# EAGLE schematic untitled (EAGLE 6.3)
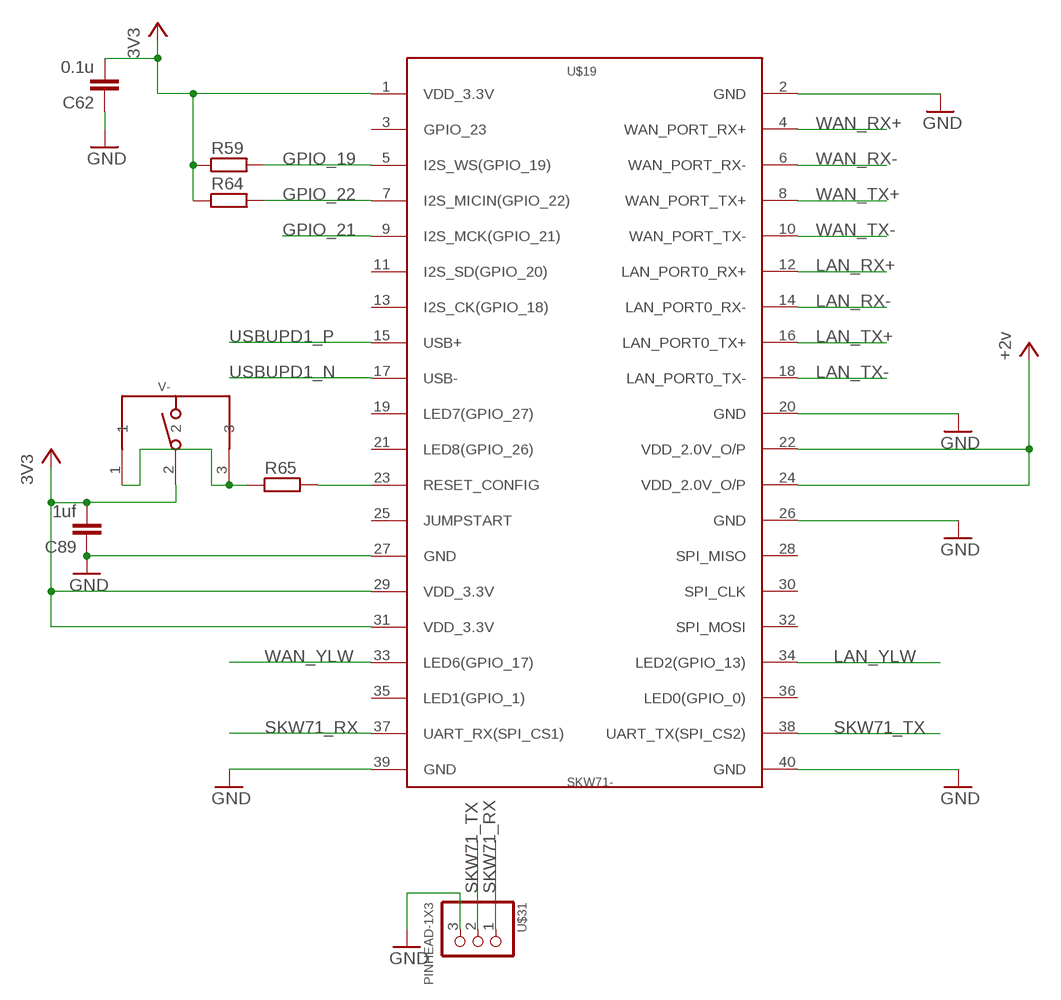
[diagram p0: schematic, sheet 1, part 1 of 3]
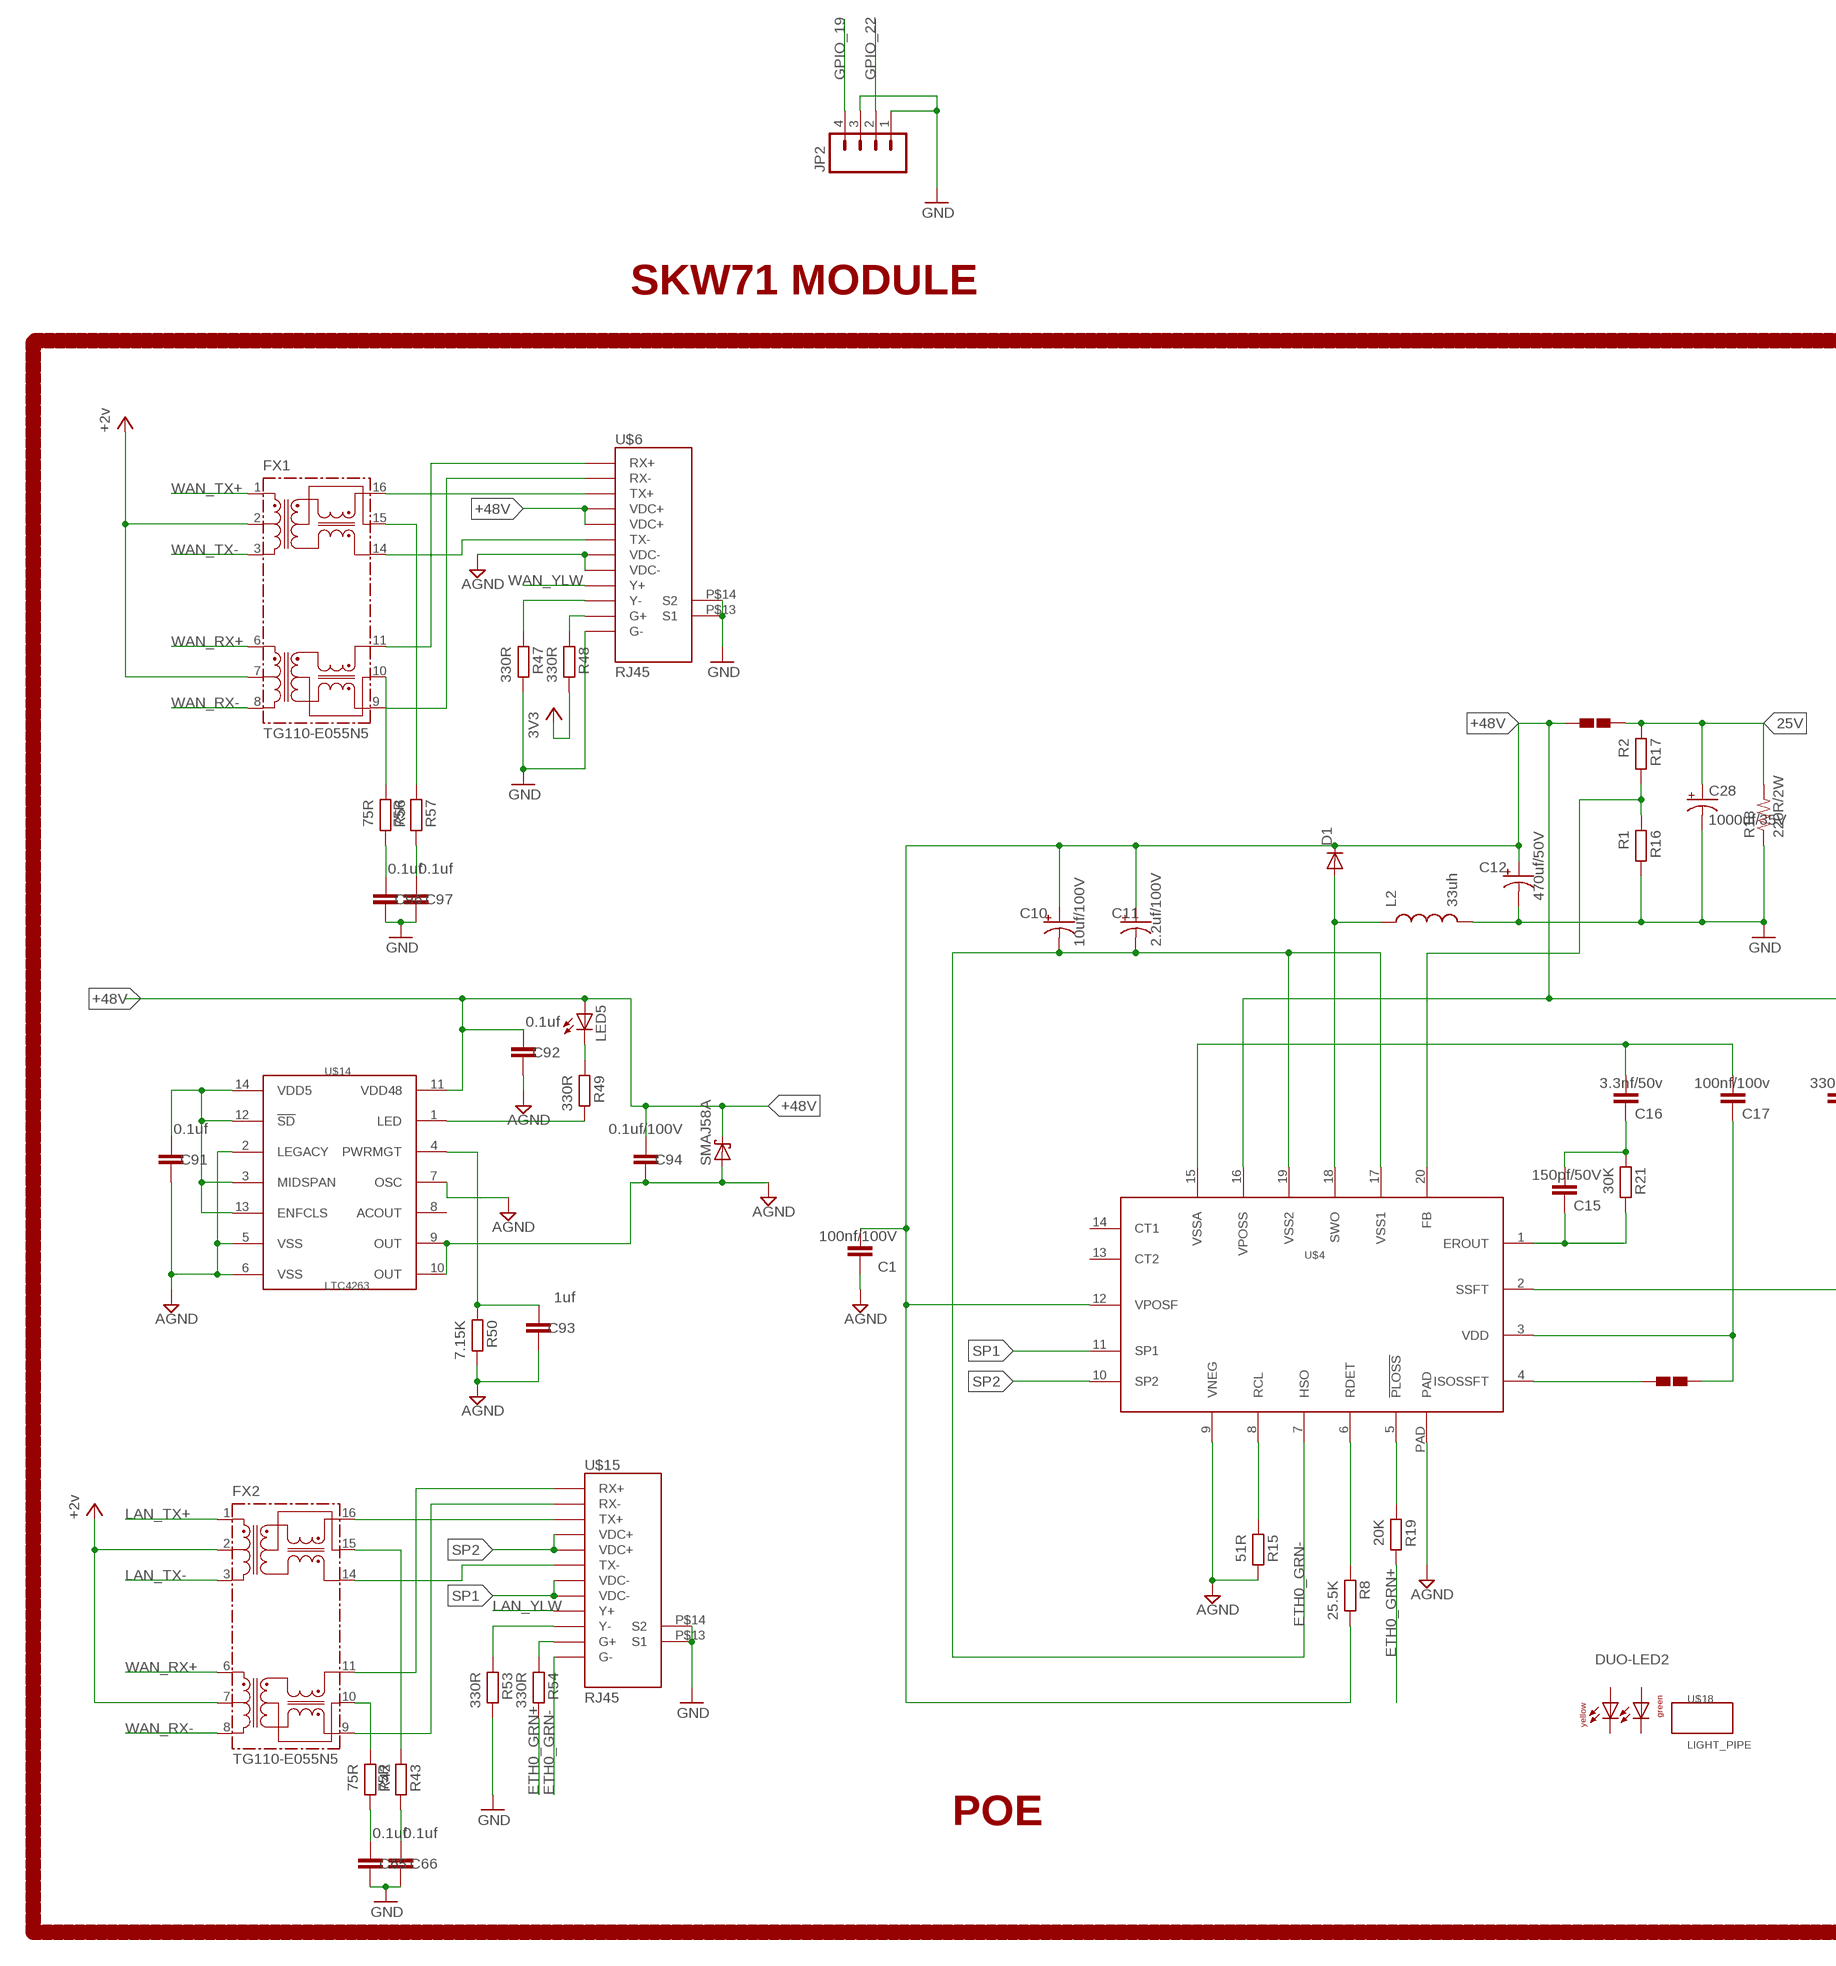
[diagram p1: schematic, sheet 1, part 2 of 3]
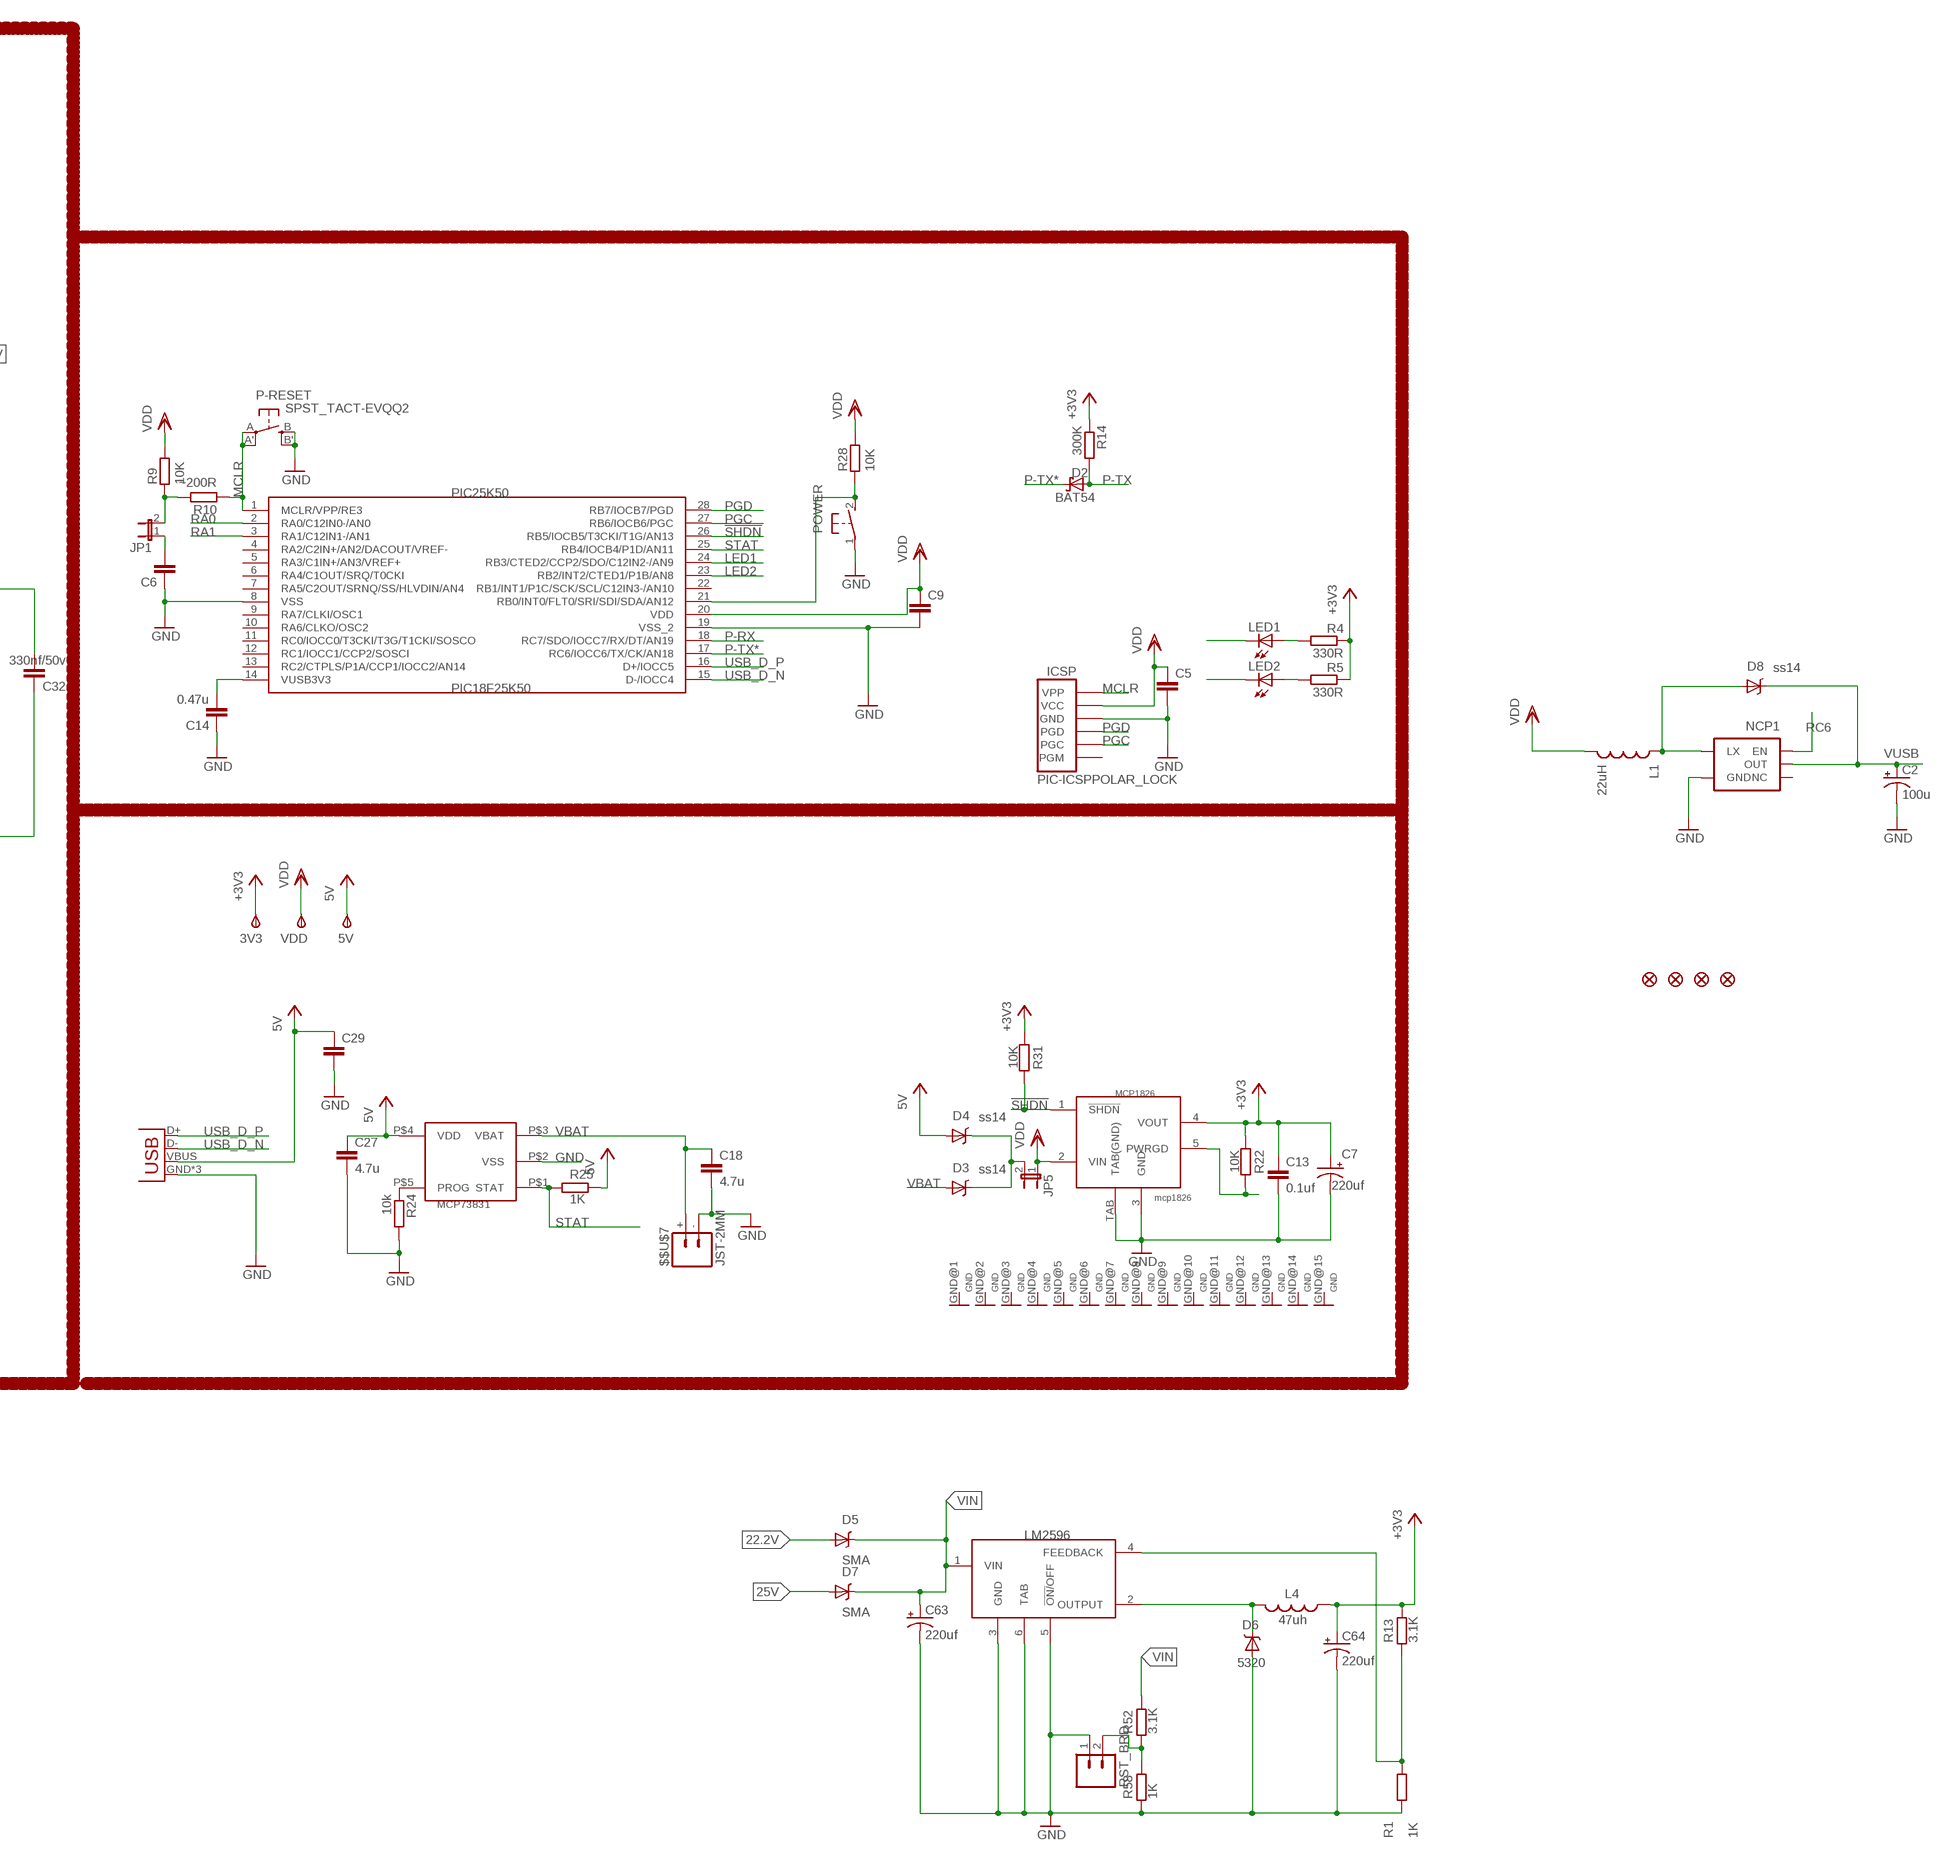
[diagram p2: schematic, sheet 1, part 3 of 3]

## Parts
3V3  TPSB2,54  [B2,54]
5V  TPSB2,54  [B2,54]
$$U$7  JST-2MM  [JST-2MM]
C1  100nf/100V  C-EUC0805  [C0805]
C2  100u  CPOL-USD  [PANASONIC_D]
C5  CAPACITOR  [C0603]
C6  CAPACITOR  [C0603]
C7  220uf  CPOL-USE2.5-6  [E2,5-6]
C9  CAPACITOR  [C0603]
C10  10uf/100V  CPOL-USE2,5-6E  [E2,5-6E]
C11  2.2uf/100V  CPOL-USE2-5  [E2-5]
C12  470uf/50V  CPOL-USE5-10.5  [E5-10,5]
C13  0.1uf  C-EUC0603  [C0603]
C14  0.47u  CAPACITOR  [C0603]
C15  150pf/50V  C-EUC0805  [C0805]
C16  3.3nf/50v  C-EUC0805  [C0805]
C17  100nf/100v  C-EUC0805  [C0805]
C18  4.7u  CAPACITOR  [C0603]
C27  4.7u  CAPACITOR  [C0603]
C28  1000uf/35V  CPOL-USE5-13  [E5-13]
C29  CAPACITOR  [C0603]
C32  330nf/50v  C-EUC0805  [C0805]
C62  0.1u  CAPACITOR  [C0603]
C63  220uf  CPOL-USD  [PANASONIC_D]
C64  220uf  CPOL-USD  [PANASONIC_D]
C65  0.1uf  CAPACITOR  [C0603]
C66  0.1uf  CAPACITOR  [C0603]
C89  1uf  CAPACITOR  [C0603]
C91  0.1uf  CAPACITOR  [C0603]
C92  0.1uf  CAPACITOR  [C0603]
C93  1uf  CAPACITOR  [C0603]
C94  0.1uf/100V  CAPACITOR  [C0603]
C96  0.1uf  CAPACITOR  [C0603]
C97  0.1uf  CAPACITOR  [C0603]
D1  DIODESMC/DO-214AB  [SMC]
D2  BAT54  [SOT23]
D3  ss14  DIODE-SCHOTTKY_  [SMA-DIODE]
D4  ss14  DIODE-SCHOTTKY_  [SMA-DIODE]
D5  SMA  DIODE-SCHOTTKY_  [SMA-DIODE]
D6  5320  DIODE-SCHOTTKY_  [SMA-DIODE]
D7  SMA  DIODE-SCHOTTKY_  [SMA-DIODE]
D8  ss14  DIODE-SCHOTTKY_  [SMA-DIODE]
DUO-LED2  DUOLED-1X2  [DUOLED-C-0603]
FID1  FIDUCIAL1X2.5  [FIDUCIAL-1X2.5]
FID2  FIDUCIAL1X2.5  [FIDUCIAL-1X2.5]
FID3  FIDUCIAL1X2.5  [FIDUCIAL-1X2.5]
FID4  FIDUCIAL1X2.5  [FIDUCIAL-1X2.5]
FX1  TG110-E055N5  [N5]
FX2  TG110-E055N5  [N5]
ICSP  PIC-ICSPPOLAR_LOCK  [MOLEX-1X6_LOCK]
JP1  JUMPER-2SMD-NC  [SJ_2S]
JP2  M04POLAR  [MOLEX-1X4]
JP4  USB-MICROB  [USB-MICROB]
JP5  JP1E  [JP1]
L1  22uH  INDUCTORCR54  [CR54]
L2  33uh  INDUCTOR  [INDUCTOR-10X9.8X6]
L4  47uh  INDUCTOR  [INDUCTOR-10X9.8X6]
LED1  LEDCHIP-LED0603  [CHIP-LED0603]
LED2  LEDCHIP-LED0603  [CHIP-LED0603]
LED5  LEDCHIP-LED0603  [CHIP-LED0603]
LM2596  LM25XX-2596  [TO-263-6(5LEADS+1TAB)]
MCP1826  mcp1826  MCP1825T  [SOT223-5]
MCP73831  MCP73831  [5PIN_SOT23]
NCP1  V_REG_NCP1400SOT23-5  [SOT23-5]
P-RESET  SPST_TACT-EVQQ2  [EVQ-Q2]
PIC25K50  PIC18F25K50  [SOIC-28]
POWER  31-XX  [B3F-31XX]
R1  1K  RESISTOR  [R0603]
R4  330R  R-EU_R0603  [R0603]
R5  330R  R-EU_R0603  [R0603]
R8  25.5K  RESISTOR  [R0603]
R9  10K  RESISTOR  [R0603]
R10  ~200R  RESISTOR  [R0603]
R13  3.1K  RESISTOR  [R0603]
R14  300K  R-EU_R0603  [R0603]
R15  51R  RESISTOR  [R0603]
R16  R1  RESISTOR  [R0603]
R17  R2  RESISTOR  [R0603]
R18  220R/2W  R-US_R2512  [R2512]
R19  20K  RESISTOR  [R0603]
R21  30K  RESISTOR  [R0603]
R22  10K  R-EU_R0603  [R0603]
R24  10k  R-EU_R0603  [R0603]
R25  1K  R-EU_R0603  [R0603]
R28  10K  RESISTOR  [R0603]
R31  10K  R-EU_R0603  [R0603]
R42  75R  RESISTOR  [R0603]
R43  75R  RESISTOR  [R0603]
R47  330R  RESISTOR  [R0603]
R48  330R  RESISTOR  [R0603]
R49  330R  RESISTOR  [R0603]
R50  7.15K  RESISTOR  [R0603]
R52  3.1K  RESISTOR  [R0603]
R53  330R  RESISTOR  [R0603]
R54  330R  RESISTOR  [R0603]
R56  75R  RESISTOR  [R0603]
R57  75R  RESISTOR  [R0603]
R58  1K  RESISTOR  [R0603]
R59  RESISTOR  [R0603]
R64  RESISTOR  [R0603]
R65  RESISTOR  [R0603]
RST_BRD  M02POLAR  [MOLEX-1X2]
SMAJ58A  SCHOTTKY-DIODESMA2  [SCHOTTKY_SMA]
U$4  SI3402  [SI3402]
U$6  RJ45  [RJ-45-NOMAGNETICS_BI-LED]
U$10  SOL-PAD-OPEN  [SOL-PAD-OPEN]
U$14  LTC4263  [SOIC-14]
U$15  RJ45  [RJ-45-NOMAGNETICS_BI-LED]
U$18  LIGHT_PIPE  [LIGHT-PIPE]
U$19  SKW71-  [SKW71-SMT]
U$28  SOL-PAD-OPEN  [SOL-PAD-OPEN]
U$31  PINHEAD-1X3  [PINHEAD-1X3-2MM]
V-  SPST-3PIN-RTANGLEP02  [TL3340AF160QG]
VDD  TPSB2,54  [B2,54]

## Nets
22.2V [power]: D5.A
25V [power]: C28.+ D7.A R17.1 R18.2 U$28.P$2
!SHDN: MCP1826.1(!SHDN) PIC25K50.26(RB5/IOCB5/T3CKI/T1G/AN13) R31.2
+2V [power]: FX1.2 FX1.7 FX2.2 FX2.7 U$19.22(VDD_2.0V_O/P) U$19.24(VDD_2.0V_O/P) ; supply symbol labelled +2v
+3V3: 3V3.TP(PP) C7.+ C13.1 C62.2 C64.+ C89.2 L4.P$1 MCP1826.4(VOUT) R4.1 R5.1 R13.2 R14.1 R22.1 R31.1 R48.2 R59.1 R64.1 U$19.1(VDD_3.3V) U$19.29(VDD_3.3V) U$19.31(VDD_3.3V) V-.2 ; supply symbol labelled 3V3
+5V: 5V.TP(PP) C27.1 C29.1 D4.A JP4.VBUS MCP73831.P$4(VDD) R25.2 ; supply symbol labelled 5V
+48V [power]: C1.2 C10.+ C11.+ C12.+ C32.2 C92.2 C94.2 D1.C LED5.A R8.2 SMAJ58A.C U$4.12(VPOSF) U$4.16(VPOSS) U$6.4(VDC+) U$6.5(VDC+) U$14.11(VDD48) U$28.P$1
AGND: C1.1 C91.1 C92.1 C93.1 C94.1 R15.2 R50.2 SMAJ58A.A U$4.9(VNEG) U$4.PAD U$6.7(VDC-) U$6.8(VDC-) U$14.2(LEGACY) U$14.5(VSS) U$14.6(VSS) U$14.7(OSC) U$14.9(OUT) U$14.10(OUT)
ETH0_GRN+: R19.2 R54.2
ETH0_GRN-: C10.- C11.- U$4.7(HSO) U$4.17(VSS1) U$4.19(VSS2) U$15.12(G-)
GND: $$U$7.- C2.- C5.2 C6.1 C7.- C9.2 C12.- C13.2 C14.1 C18.2 C27.2 C28.- C29.2 C62.1 C63.- C64.- C65.1 C66.1 C89.1 C96.1 C97.1 D6.A ICSP.4(GND) JP2.1 JP2.3 JP4.GND JP4.MT1(GND) JP4.MT2(GND) L2.P$2 LM2596.3(GND) LM2596.5(!ON/!OFF) LM2596.6(TAB) MCP1826.3(GND) MCP1826.TAB(TAB(GND)) MCP73831.P$2(VSS) NCP1.4(GND) P-RESET.B'(S1) P-RESET.B(S) PIC25K50.8(VSS) PIC25K50.19(VSS_2) POWER.1(P) R1.1 R16.2 R18.1 R24.2 R47.2 R53.2 R58.1 RST_BRD.1 U$6.12(G-) U$6.P$13(S1) U$6.P$14(S2) U$15.P$13(S1) U$15.P$14(S2) U$19.2(GND) U$19.20(GND) U$19.26(GND) U$19.27(GND) U$19.39(GND) U$19.40(GND) U$31.3
GPIO_19: JP2.4 R59.2 U$19.5(I2S_WS(GPIO_19))
GPIO_21: U$19.9(I2S_MCK(GPIO_21))
GPIO_22: JP2.2 R64.2 U$19.7(I2S_MICIN(GPIO_22))
LAN_RX+: U$19.12(LAN_PORT0_RX+)
LAN_RX-: U$19.14(LAN_PORT0_RX-)
LAN_TX+: FX2.1 U$19.16(LAN_PORT0_TX+)
LAN_TX-: FX2.3 U$19.18(LAN_PORT0_TX-)
LAN_YLW: U$15.9(Y+) U$19.34(LED2(GPIO_13))
LED1: LED1.C PIC25K50.24(RB3/CTED2/CCP2/SDO/C12IN2-/AN9)
LED2: LED2.C PIC25K50.23(RB2/INT2/CTED1/P1B/AN8)
MCLR: ICSP.6(VPP) P-RESET.A'(P1) P-RESET.A(P) PIC25K50.1(MCLR/VPP/RE3) R10.1
N$1: D8.A L1.P$1 NCP1.5(LX)
N$3: LED1.A R4.2
N$4: LED2.A R5.2
N$8: R8.1 U$4.6(RDET)
N$9: R15.1 U$4.8(RCL)
N$10: D1.A L2.P$1 U$4.18(SWO)
N$11: U$4.4(ISOSSFT) U$10.P$1
N$12: C17.1 U$4.3(VDD) U$10.P$2
N$13: C15.1 R21.2 U$4.1(EROUT)
N$15: C32.1 U$4.2(SSFT)
N$16: R16.1 R17.2 U$4.20(FB)
N$17: C16.2 C17.2 U$4.15(VSSA)
N$18: R19.1 U$4.5(!PLOSS)
N$19: FX1.16 U$6.3(TX+)
N$20: D3.C D4.C JP5.2
N$21: FX1.14 U$6.6(TX-)
N$22: C91.2 U$14.3(MIDSPAN) U$14.12(!SD) U$14.13(ENFCLS) U$14.14(VDD5)
N$23: FX1.15 R57.1
N$24: FX1.10 R56.1
N$25: C97.2 R57.2
N$26: R65.1 V-.1 V-.3
N$32: C96.2 R56.2
N$34: C15.2 C16.1 R21.1
N$35: C6.2 JP1.1
N$37: JP1.2 R9.1 R10.2
N$38: C14.2 PIC25K50.14(VUSB3V3)
N$39: MCP1826.5(PWRGD) R22.2
N$41: MCP73831.P$5(PROG) R24.1
N$44: D6.C L4.P$2 LM2596.2(OUTPUT)
N$61: LM2596.4(FEEDBACK) R1.2 R13.1
N$69: C65.2 R42.2
N$70: C66.2 R43.2
N$73: FX2.15 R43.1
N$74: FX2.10 R42.1
N$75: FX1.11 U$6.1(RX+)
N$77: FX1.9 U$6.2(RX-)
N$78: R47.1 U$6.10(Y-)
N$79: R48.1 U$6.11(G+)
N$80: FX2.16 U$15.3(TX+)
N$87: FX2.14 U$15.6(TX-)
N$88: FX2.11 U$15.1(RX+)
N$89: FX2.9 U$15.2(RX-)
N$90: R52.1 R58.2 RST_BRD.2
N$91: R53.1 U$15.10(Y-)
N$92: LED5.C R49.1
N$93: R49.2 U$14.1(LED)
N$94: C93.2 R50.1 U$14.4(PWRMGT)
N$95: R54.1 U$15.11(G+)
N$97: R65.2 U$19.23(RESET_CONFIG)
P-RX: PIC25K50.18(RC7/SDO/IOCC7/RX/DT/AN19)
P-TX: D2.1(A) R14.2
P-TX*: D2.3(C) PIC25K50.17(RC6/IOCC6/TX/CK/AN18)
PGC: ICSP.2(PGC) PIC25K50.27(RB6/IOCB6/PGC)
PGD: ICSP.3(PGD) PIC25K50.28(RB7/IOCB7/PGD)
RA0: PIC25K50.2(RA0/C12IN0-/AN0)
RA1: PIC25K50.3(RA1/C12IN1-/AN1)
RB0: PIC25K50.21(RB0/INT0/FLT0/SRI/SDI/SDA/AN12) POWER.2(S) R28.1
RC6: NCP1.1(EN)
SKW71_RX: U$19.37(UART_RX(SPI_CS1)) U$31.1
SKW71_TX: U$19.38(UART_TX(SPI_CS2)) U$31.2
SP1: U$4.11(SP1) U$15.7(VDC-) U$15.8(VDC-)
SP2: U$4.10(SP2) U$15.4(VDC+) U$15.5(VDC+)
STAT: MCP73831.P$1(STAT) PIC25K50.25(RB4/IOCB4/P1D/AN11) R25.1
USB_D_N: JP4.D- PIC25K50.15(D-/IOCC4)
USB_D_P: JP4.D+ PIC25K50.16(D+/IOCC5)
USBUPD1_N: U$19.17(USB-)
USBUPD1_P: U$19.15(USB+)
VBAT: $$U$7.+ C18.1 D3.A MCP73831.P$3(VBAT)
VDD: C5.1 C9.1 ICSP.5(VCC) JP5.1 L1.P$2 MCP1826.2(VIN) PIC25K50.20(VDD) R9.2 R28.2 VDD.TP(PP)
VIN [power]: C63.+ D5.C D7.C LM2596.1(VIN) R52.2
VUSB: C2.+ D8.C NCP1.2(OUT)
WAN_RX+: FX1.6 FX2.6 U$19.4(WAN_PORT_RX+)
WAN_RX-: FX1.8 FX2.8 U$19.6(WAN_PORT_RX-)
WAN_TX+: FX1.1 U$19.8(WAN_PORT_TX+)
WAN_TX-: FX1.3 U$19.10(WAN_PORT_TX-)
WAN_YLW: U$6.9(Y+) U$19.33(LED6(GPIO_17))
Unconnected: DUO-LED2.A1 DUO-LED2.A2 DUO-LED2.C1 DUO-LED2.C2 ICSP.1(PGM) NCP1.3(NC) PIC25K50.4(RA2/C2IN+/AN2/DACOUT/VREF-) PIC25K50.5(RA3/C1IN+/AN3/VREF+) PIC25K50.6(RA4/C1OUT/SRQ/T0CKI) PIC25K50.7(RA5/C2OUT/SRNQ/SS/HLVDIN/AN4) PIC25K50.9(RA7/CLKI/OSC1) PIC25K50.10(RA6/CLKO/OSC2) PIC25K50.11(RC0/IOCC0/T3CKI/T3G/T1CKI/SOSCO) PIC25K50.12(RC1/IOCC1/CCP2/SOSCI) PIC25K50.13(RC2/CTPLS/P1A/CCP1/IOCC2/AN14) PIC25K50.22(RB1/INT1/P1C/SCK/SCL/C12IN3-/AN10) U$4.13(CT2) U$4.14(CT1) U$14.8(ACOUT) U$19.3(GPIO_23) U$19.11(I2S_SD(GPIO_20)) U$19.13(I2S_CK(GPIO_18)) U$19.19(LED7(GPIO_27)) U$19.21(LED8(GPIO_26)) U$19.25(JUMPSTART) U$19.28(SPI_MISO) U$19.30(SPI_CLK) U$19.32(SPI_MOSI) U$19.35(LED1(GPIO_1)) U$19.36(LED0(GPIO_0))

## Notes on the sheet
- SKW71 MODULE
- POE

## Power pins joined to a net without a drawn wire
GND: MCP1826.GND@1(GND) MCP1826.GND@2(GND) MCP1826.GND@3(GND) MCP1826.GND@4(GND) MCP1826.GND@5(GND) MCP1826.GND@6(GND) MCP1826.GND@7(GND) MCP1826.GND@8(GND) MCP1826.GND@9(GND) MCP1826.GND@10(GND) MCP1826.GND@11(GND) MCP1826.GND@12(GND) MCP1826.GND@13(GND) MCP1826.GND@14(GND) MCP1826.GND@15(GND)

## Library data of the parts
3V3 5V VDD = testpad:TPS: TEST PIN
$$U$7 = BaseApp:JST-2MM
C1 C13 C15-C17 C32 = rcl:C-EU: CAPACITOR, European symbol
C2 = rcl:CPOL-US: POLARIZED CAPACITOR, American symbol
C5 C6 C9 C14 C18 C27 C29 C62 C65 C66 C89 C91-C94 C96 C97 = BaseApp:CAPACITOR: C0402 & C0603 are general chip capacitors Film Capacitor, 400V's Mouser Part No :- __ECQ-E4474KF__
C7 C11 C28 C63 C64 = adafruit:CPOL-US: POLARIZED CAPACITOR, American symbol
C10 C12 = adafruit2:CPOL-US: POLARIZED CAPACITOR, American symbol
D1 = SparkFun-DiscreteSemi:DIODE: Diode These are standard reverse protection diodes and small signal diodes. SMA package can handle up to about 1A. SOD-323 can handle about 200mA. What the SOD-323 package when ordering, there are some mfgs out there that are 5-pin packages.
D2 = diode:BAT54: Schottky Diodes Source: Fairchild .. BAT54.pdf
D3-D8 = SparkFun:DIODE-SCHOTTKY
DUO-LED2 = BaseApp:DUOLED-1X2: Digikey No :- __754-1146-1-ND__
FID1-FID4 = SparkFun-Aesthetics:FIDUCIAL: Fiducial Alignment Points Various fiducial points for machine vision alignment.
FX1 FX2 = halo-electronics:TG110-E*N5: E-Ultra (TM) 10/100BASE-TX SOIC-16 Fast Ethernet Magnetic Modules Source: www.haloelectronics.com .. e-ultra.pdf
ICSP = SparkFun-Connectors:PIC-ICSP: ISCP Programming connector for UAV, UBW Kit, etc.
JP1 = SparkFun-Passives:JUMPER-2: Jumper Basic 0.1" spaced jumper. Use with breakaway headers.
JP2 = SparkFun-Connectors:M04: Header 4 Standard 4-pin 0.1" header. Use with straight break away headers (SKU : PRT-00116), right angle break away headers (PRT-00553), swiss pins (PRT-00743), machine pins (PRT-00117), and female headers (PRT-00115). Molex polarized connector foot print use with SKU : PRT-08231 with associated crimp pins and housings. 1MM SMD Version SKU: PRT-10208
JP4 = SparkFun-Connectors:USB: USB Connectors USB-B-PTH is fully proven SKU : PRT-00139/CONN-08278 USB-miniB is fully proven SKU : PRT-00587 USB-A-PCB is untested. USB-A-H is throughly reviewed, but untested. Spark Fun Electronics SKU : PRT-00437 USB-B-SMT is throughly reviewed, but untested. Needs silkscreen touching up. USB-A-S has not been used/tested USB-MB-H has not been used/tested USB-MICROB has been used. CONN-09505; PROD_ID: CONN-09505
JP5 = jumper:JP1E: JUMPER
L1 = SparkFun:INDUCTOR: Inductors Basic Inductor/Choke - 0603 and 1206. Footprints are not proven and vary greatly between part numbers.
L2 L4 = BaseApp:INDUCTOR
LED1 LED2 LED5 = adafruit:LED: LED OSRAM: - CHIPLED LG R971, LG N971, LY N971, LG Q971, LY Q971, LO R971, LY R971 LH N974, LH R974 LS Q976, LO Q976, LY Q976 LO Q996 - Hyper CHIPLED LW Q18S LB Q993, LB Q99A, LB R99A - SideLED LS A670, LO A670, LY A670, LG A670, LP A670 LB A673, LV A673, LT A673, LW A673 LH A674 LY A675 LS A676, LA A676, LO A676, LY A676, LW A676 LS A679, LY A679, LG A679 - Hyper Micro SIDELED® LS Y876, LA Y876, LO Y876, LY Y876 LT Y87S - SmartLED LW L88C, LW L88S LB L89C, LB L89S, LG L890 LS L89K, LO L89K, LY L89K LS L896, LA L896, LO L896, LY L896 - TOPLED LS T670, LO T670, LY T670, LG T670, LP T670 LSG T670, LSP T670, LSY T670, LOP T670, LYG T670 LG T671, LOG T671, LSG T671 LB T673, LV T673, LT T673, LW T673 LH T674 LS T676, LA T676, LO T676, LY T676, LB T676, LH T676, LSB T676, LW T676 LB T67C, LV T67C, LT T67C, LS T67K, LO T67K, LY T67K, LW E67C LS E67B, LA E67B, LO E67B, LY E67B, LB E67C, LV E67C, LT E67C LW T67C LS T679, LY T679, LG T679 LS T770, LO T770, LY T770, LG T770, LP T770 LB T773, LV T773, LT T773, LW T773 LH T774 LS E675, LA E675, LY E675, LS T675 LS T776, LA T776, LO T776, LY T776, LB T776 LHGB T686 LT T68C, LB T68C - Hyper Mini TOPLED® LB M676 - Mini TOPLED Santana® LG M470 LS M47K, LO M47K, LY M47K Source: http://www.osram.convergy.de/
LM2596 = BaseApp:LM25XX: LM2576 http://www.digikey.com/product-detail/en/LM2576D2TR4-5G/LM2576D2TR4-5GOSCT-ND/2120633
MCP1826 = BaseApp:MCP1825T: Digikey No:- __MCP1825T-5002E/DCCT-ND__
MCP73831 = BaseApp:MCP73831: MCP73831T-2ACI/OT http://www.digikey.com/product-detail/en/MCP73831T-2ACI%2FOT/MCP73831T-2ACI%2FOTCT-ND/1979802
NCP1 = SparkFun:V_REG_NCP1400: Switching step-up voltage regulator NCP1400 switiching regulator takes single cell AA and outputs 100mA at 3.3V or 5V with minimal number of external components.
P-RESET = adafruit:SPST_TACT: SMT 6mm switch, EVQQ2 series http://www.ladyada.net/library/eagle
PIC25K50 = BaseApp:PIC18F25K50
POWER = switch-omron:31-XX: OMRON SWITCH; MPN: B3F-3100; OC_FARNELL: 959704; OC_NEWARK: 36M3582
R1 R8-R10 R13 R15-R17 R19 R21 R28 R42 R43 R47-R50 R52-R54 R56-R59 R64 R65 = BaseApp:RESISTOR: Resistance Package :- 0603 Mount :-Surface mount
R4 R5 R14 R24 = rcl:R-EU_: RESISTOR, European symbol
R18 = adafruit:R-US_: RESISTOR, American symbol
R22 R25 R31 = resistor:R-EU_: RESISTOR, European symbol
RST_BRD = SparkFun-Connectors:M02: Header 2 Standard 2-pin 0.1" header. Use with straight break away headers (SKU : PRT-00116), right angle break away headers (PRT-00553), swiss pins (PRT-00743), machine pins (PRT-00117), and female headers (PRT-00115). Molex polarized connector foot print use with SKU : PRT-08233 with associated crimp pins and housings.
SMAJ58A = BaseApp:SCHOTTKY-DIODE
U$4 = BaseApp:SI3402: FULLY-INTEGRATED 802.3-COMPLIANT POE PD INTERFACE AND LOW-EMI SWITCHING REGULATOR
U$6 U$15 = BaseApp:RJ45: Digikey No. :- __380-1279-ND__
U$10 U$28 = BaseApp:SOL-PAD-OPEN
U$14 = BaseApp:LTC4263: Digikey No. :- __LTC4263CS#PBF-ND__
U$18 = BaseApp:LIGHT_PIPE: Digikey No :- __492-1313-ND__
U$19 = BaseApp:SKW71
U$31 = BaseApp:PINHEAD-1X3
V- = BaseApp:SPST-3PIN-RTANGLE: Digikey No. :- __EG4627CT-ND__

## Net classes
0 default: width 0.127 mm, drill 0.127 mm, clearance 0.127 mm
1 power: width 0.406 mm, drill 1.1 mm, clearance 0.2 mm
2 gnd: width 0.2 mm, drill 0.305 mm, clearance 0.2 mm